# EasyEDA Pro project ProPrj_MiniFoc_AT32F435.epro, schematic 核心板
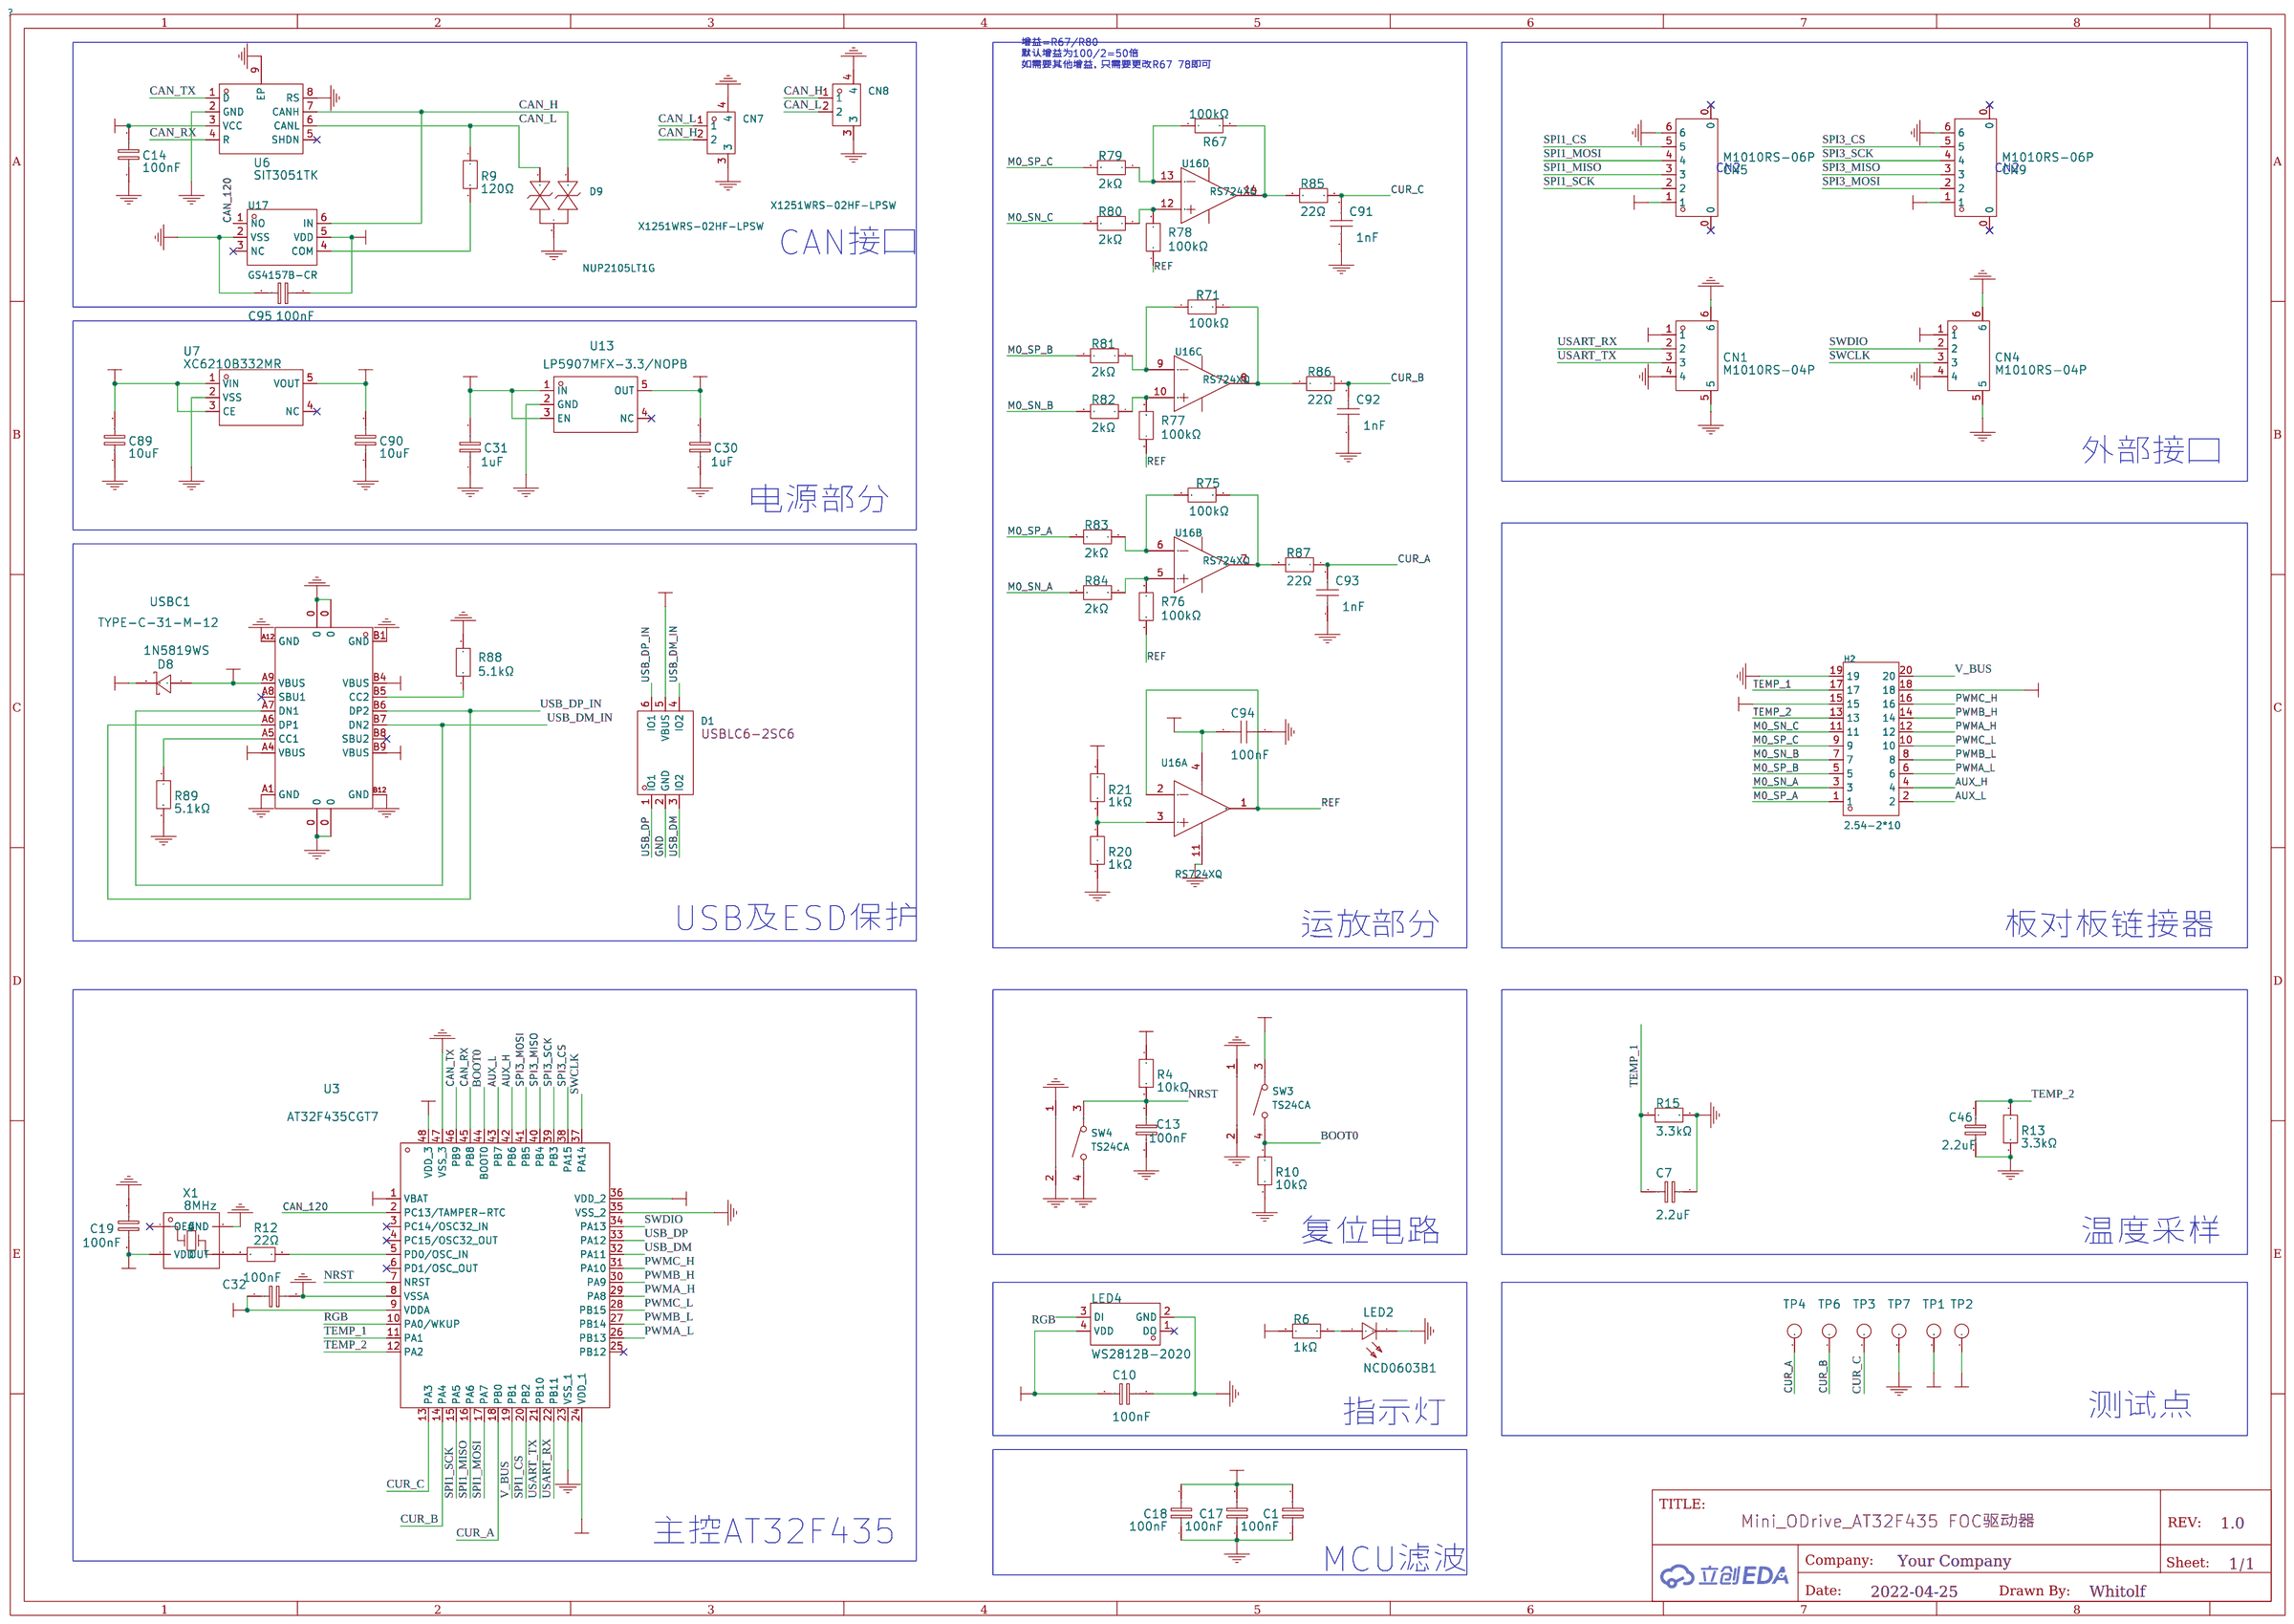
[diagram p0: schematic sheet]

## Parts
C1  100nF  [C0603_SMALL]
C7  2.2uF  [C0603_SMALL]
C10  100nF  [C0603_SMALL]
C13  100nF  [C0603_SMALL]
C14  100nF  [C0603_SMALL]
C17  100nF  [C0603_SMALL]
C18  100nF  [C0603_SMALL]
C19  100nF  [C0603_SMALL]
C30  1uF  [C0603_SMALL]
C31  1uF  [C0603_SMALL]
C32  100nF  [C0603_SMALL]
C46  2.2uF  [C0603_SMALL]
C89  10uF  [C0603_SMALL]
C90  10uF  [C0603_SMALL]
C91  1nF  [C0603_SMALL]
C92  1nF  [C0603_SMALL]
C93  1nF  [C0603_SMALL]
C94  100nF  [C0603_SMALL]
C95  100nF  [C0603_SMALL]
CN1  M1010RS-04P  [CONN-SMD_M1010RS-04P]
CN4  M1010RS-04P  [CONN-SMD_M1010RS-04P]
CN5  M1010RS-06P  [CONN-SMD_M1010RS-06P]
CN7  X1251WRS-02HF-LPSW  [CONN-SMD_2P-P1.25_X1251WRS-02HF-LPSW]
CN8  X1251WRS-02HF-LPSW  [CONN-SMD_2P-P1.25_X1251WRS-02HF-LPSW]
CN9  M1010RS-06P  [CONN-SMD_M1010RS-06P]
D1  -  [SOT-23-6_L2.9-W1.6-P0.95-LS2.8-BL]
D8  1N5819WS  [SOD-323_L1.8-W1.3-LS2.5-RD]
D9  NUP2105LT1G  [SOT-23-3_L2.9-W1.3-P1.90-LS2.4-BR]
H2  2.54-2*10  [HDR-TH_20P-P2.54-V-M-R2-C10-S2.54]
LED2  NCD0603B1  [LED0603_RED_SMALL]
LED4  WS2812B-2020  [LED-SMD_4P-L2.0-W2.0-TL_WS2812B-2020]
R4  10kΩ  [R0603_SMALL]
R6  1kΩ  [R0603_SMALL]
R9  120Ω  [R0603_SMALL]
R10  10kΩ  [R0603_SMALL]
R12  22Ω  [R0603_SMALL]
R13  3.3kΩ  [R0603_SMALL]
R15  3.3kΩ  [R0603_SMALL]
R20  1kΩ  [R0603_SMALL]
R21  1kΩ  [R0603_SMALL]
R67  100kΩ  [R0603_SMALL]
R71  100kΩ  [R0603_SMALL]
R75  100kΩ  [R0603_SMALL]
R76  100kΩ  [R0603_SMALL]
R77  100kΩ  [R0603_SMALL]
R78  100kΩ  [R0603_SMALL]
R79  2kΩ  [R0603_SMALL]
R80  2kΩ  [R0603_SMALL]
R81  2kΩ  [R0603_SMALL]
R82  2kΩ  [R0603_SMALL]
R83  2kΩ  [R0603_SMALL]
R84  2kΩ  [R0603_SMALL]
R85  22Ω  [R0603_SMALL]
R86  22Ω  [R0603_SMALL]
R87  22Ω  [R0603_SMALL]
R88  5.1kΩ  [R0603_SMALL]
R89  5.1kΩ  [R0603_SMALL]
SW3  TS24CA  [SW-SMD_TS24CA]
SW4  TS24CA  [SW-SMD_TS24CA]
TP1  Testpoint 1.6mm  [TESTPOINT 1.6MM]  (no BOM)
TP2  Testpoint 1.6mm  [TESTPOINT 1.6MM]  (no BOM)
TP3  Testpoint 1.6mm  [TESTPOINT 1.6MM]  (no BOM)
TP4  Testpoint 1.6mm  [TESTPOINT 1.6MM]  (no BOM)
TP6  Testpoint 1.6mm  [TESTPOINT 1.6MM]  (no BOM)
TP7  Testpoint 1.6mm  [TESTPOINT 1.6MM]  (no BOM)
U3  AT32F435CGT7  [LQFP-48_L7.0-W7.0-P0.50-LS9.0-BL]
U6  SIT3051TK  [DFN-8_L3.0-W3.0-P0.65-BL-EP]
U7  XC6210B332MR  [SOT-25_L3.0-W1.6-P0.95-LS2.8-BL]
U13  LP5907MFX-3.3/NOPB  [SOT-23-5_L3.0-W1.7-P0.95-LS2.8-BR]
U16  RS724XQ  [TSSOP-14_L5.0-W4.4-P0.65-LS6.4-BL]  (sections 1,2,3,4)
U17  GS4157B-CR  [SC70-6_L2.1-W1.3-P0.65-LS2.3-BL]
USBC1  TYPE-C-31-M-12  [USB-C_SMD-TYPE-C-31-M-12]
X1  8MHz  [OSC-SMD_4P-L2.5-W2.0-BL_DSB321SDA]

## Library data of the parts
C1 C10 C13 C14 C17-C19 C32 C95 = CC0603KRX7R9BB104: 容值:100nF;精度:±10%;额定电压:50V;材质(温度系数):X7R;; LCSC Part Name: 100nF ±10% 50V; Supplier Part: C14663; Manufacturer: YAGEO(国巨); Supplier Footprint: 0603; JLCPCB Part Class: Basic Part; Datasheet: https://atta.szlcsc.com/upload/public/pdf/source/20180910/C282072_33301C7F631E79921B82A8DAC6BCC5B3.pdf; Supplier: LCSC; Tolerance: ±10%; Voltage Rated: 50V; Temperature Coefficient: X7R; Check: true
C7 C46 = CL10A225KO8NNNC: 容值:2.2uF;精度:±10%;额定电压:16V;材质(温度系数):X5R;; LCSC Part Name: 2.2uF ±10% 16V; Supplier Part: C23630; Manufacturer: SAMSUNG(三星); Supplier Footprint: 0603; JLCPCB Part Class: Basic Part; Datasheet: https://atta.szlcsc.com/upload/public/pdf/source/20160218/1457707763339.pdf; Supplier: LCSC; Tolerance: ±10%; Voltage Rated: 16V; Temperature Coefficient: X5R; Check: true
C30 C31 C91-C93 = CC0603KRX5R8BB105: 容值:1uF;精度:±10%;额定电压:25V;材质(温度系数):X5R;; LCSC Part Name: 1uF ±10% 25V; Supplier Part: C14664; Manufacturer: YAGEO(国巨); Supplier Footprint: 0603; JLCPCB Part Class: Extended Part; Datasheet: https://atta.szlcsc.com/upload/public/pdf/source/20160606/1465200209684.pdf; Supplier: LCSC; Tolerance: ±10%; Voltage Rated: 25V; Temperature Coefficient: X5R; Check: true
C89 C90 = GRM188R6YA106MA73D: 容值:10uF;精度:±20%;额定电压:35V;材质(温度系数):-;; LCSC Part Name: 10uF ±20% 35V; Supplier Part: C194427; Manufacturer: muRata(村田); Supplier Footprint: 0603; JLCPCB Part Class: Extended Part; Datasheet: https://atta.szlcsc.com/upload/public/pdf/source/20210128/C194427_FCA3640823207DDB58700A82F1A19B5F.pdf; Supplier: LCSC; Tolerance: ±20%; Voltage Rated: 35V; Check: true
C94 = CC0603KRX5R8BB105: 容值:1uF;精度:±10%;额定电压:25V;材质(温度系数):X5R;; LCSC Part Name: 1uF ±10% 25V; Supplier Part: C14663; Manufacturer: YAGEO(国巨); Manufacturer Part: CC0603KRX7R9BB104; Supplier Footprint: 0603; JLCPCB Part Class: Extended Part; Datasheet: https://atta.szlcsc.com/upload/public/pdf/source/20160606/1465200209684.pdf; Supplier: LCSC; Tolerance: ±10%; Voltage Rated: 25V; Temperature Coefficient: X5R; Check: true
CN1 CN4 = M1010RS-04P: 参考系列:-;间距:1mm;插针结构:1x4P;排数:1;每排PIN数:4;行距:-;公母:公型插针;安装方式:卧贴;额定电流:1A;工作温度范围:-25℃~+85℃;; LCSC Part Name: 针座 SH 间距1.0mm 4P 卧式贴片 SH; Supplier Part: C541846; Manufacturer: XFCN(台湾兴飞); Supplier Footprint: SMD,P=1mm; JLCPCB Part Class: Extended Part; Datasheet: https://atta.szlcsc.com/upload/public/pdf/source/20200518/C541847_4FBBB7CE1CCFE042AF6DD43CBAA42E89.pdf; Supplier: LCSC; Pitch: 1mm; Pins Structure: 1x4P; Number of Rows: 1; Number of PINs Per Row: 4; Gender: 公型插针; Mounting Style: 卧贴; Current Rating (Max): 1A; Operating Temperature Range: -25℃~+85℃
CN5 CN9 = M1010RS-06P: 参考系列:-;间距:1mm;插针结构:1x6P;排数:1;每排PIN数:6;行距:-;公母:公型插针;安装方式:卧贴;额定电流:1A;工作温度范围:-25℃~+85℃;; LCSC Part Name: 针座 SH 间距1.0mm 6P 卧式贴片 SH; Supplier Part: C541848; Manufacturer: XFCN(台湾兴飞); Supplier Footprint: SMD,P=1mm; JLCPCB Part Class: Extended Part; Datasheet: https://atta.szlcsc.com/upload/public/pdf/source/20200518/C541847_4FBBB7CE1CCFE042AF6DD43CBAA42E89.pdf; Supplier: LCSC; Pitch: 1mm; Pins Structure: 1x6P; Number of Rows: 1; Number of PINs Per Row: 6; Gender: 公型插针; Mounting Style: 卧贴; Current Rating (Max): 1A; Operating Temperature Range: -25℃~+85℃
CN7 CN8 = X1251WRS-02HF-LPSW: 参考系列:GH;间距:1.25mm;插针结构:1x2P;排数:1;每排PIN数:2;行距:-;公母:母型插口;安装方式:卧贴;额定电流:1A;触头材质:磷青铜;触头镀层:锡;工作温度范围:-40℃~+110℃;焊接温度(最大值):260℃;; LCSC Part Name: GH 1.25mm 1x2P 卧贴 GH; Supplier Part: C388707; Manufacturer: XKB Connectivity(中国星坤); Supplier Footprint: SMD,P=1.25mm; JLCPCB Part Class: Extended Part; Datasheet: https://atta.szlcsc.com/upload/public/pdf/source/20211011/E2F7306AE87519079AD4EC816349A567.pdf; Supplier: LCSC; Reference Series: GH; Pitch: 1.25mm; Pins Structure: 1x2P; Number of Rows: 1; Number of PINs Per Row: 2; Gender: 母型插口; Mounting Style: 卧贴; Current Rating (Max): 1A; Contact Material: 磷青铜; Contact Plating: 锡; Operating Temperature Range: -40℃~+110℃; Welding Temperature (Max): 260℃
D1 = USBLC6-2SC6: 极性:-;反向关断电压（典型值）:-;击穿电压（最小值）:-;箝位电压:-;峰值脉冲电流（10/1000us）:-;; Supplier Part: C2827654; Manufacturer: TECH PUBLIC(台舟); Supplier Footprint: SOT-23-6; JLCPCB Part Class: Extended Part; Datasheet: https://atta.szlcsc.com/upload/public/pdf/source/20210810/FBD75DE717D6D97BAC6DD7F2B5C09DCD.pdf; Supplier: LCSC
D8 = 1N5819WS_C191023: 直流反向耐压(Vr):40V;平均整流电流(Io):1A;正向压降(Vf):600mV@1A;; LCSC Part Name: 40V 1A 600mV@1A; Supplier Part: C191023; Manufacturer: Hottech(合科泰); Supplier Footprint: SOD-323; JLCPCB Part Class: Basic Part; Datasheet: https://atta.szlcsc.com/upload/public/pdf/source/20220428/3CB86FD8D28D653594B4E35F9D5AEFD9.pdf; Supplier: LCSC; Reverse Voltage (Vr): 40V; Average Rectified Current (Io): 1A; Forward Voltage (Vf@If): 600mV@1A
D9 = NUP2105LT1G_C2890118: Supplier Part: C2890118; Manufacturer: TECH PUBLIC(台舟); Supplier Footprint: SOT-23; JLCPCB Part Class: 扩展库; Datasheet: https://atta.szlcsc.com/upload/public/pdf/source/20210903/C2631C2D315C3B4D2530AFC6AAB84809.pdf; Supplier: LCSC
H2 = 2.54-2*10: 排针 2*10 2.54 11.6 MMROHS; LCSC Part Name: 排针 2*10 2.54 11.6 MMROHS; Supplier Part: C5116480; Manufacturer: ZHOURI(洲日); Supplier Footprint: 插件,P=2.54mm; JLCPCB Part Class: 扩展库; Datasheet: https://atta.szlcsc.com/upload/public/pdf/source/20220412/C6BEA3D643D1CE07163CD717B50927E0.pdf; Supplier: LCSC
LED2 = NCD0603B1: 发光颜色:蓝灯;; LCSC Part Name: 蓝灯; Supplier Part: C84266; Manufacturer: 国星光电; Supplier Footprint: 0603; JLCPCB Part Class: Extended Part; Datasheet: https://atta.szlcsc.com/upload/public/pdf/source/20200820/C84266_6A3CDBEFA72C6CAD68EDA53474ADAE6C.pdf; Supplier: LCSC; Emitted Color: 蓝灯
LED4 = WS2812B-2020: 发光颜色:RGB三色;二极管配置:-;透镜颜色:-;主波长:470.4nm；622.5nm；515.6nm;峰值波长:-;色温:-;测试电流:12mA;功率:-;发光角度:-;安装方式:-;工作温度:-;; LCSC Part Name: RGB三色 470.4nm 515.6nm 622.5nm （注意防潮，请查阅规格书中对应具体内容）; Supplier Part: C965555; Manufacturer: worldsemi; Supplier Footprint: SMD,2x2mm; JLCPCB Part Class: Extended Part; Datasheet: https://atta.szlcsc.com/upload/public/pdf/source/20201203/C965555_5C919C4B6231E6ADE06011FB0D94282B.pdf; Supplier: LCSC; Emitted Color: RGB三色; Dominant Wavelength: 470.4nm；622.5nm；515.6nm; Forward Current: 12mA
R4 R10 R88 R89 = CR0603JA0103G: 电阻类型:厚膜电阻;阻值:10kΩ;精度:±5%;功率:100mW;温度系数:±200ppm/℃;最大工作电压:50V;工作温度范围:-55℃~+125℃;; LCSC Part Name: 10kΩ ±5% 100mW; Supplier Part: C101254; Manufacturer: LIZ(丽智电子); Supplier Footprint: 0603; JLCPCB Part Class: Extended Part; Datasheet: https://atta.szlcsc.com/upload/public/pdf/source/20170408/1491631441449.pdf; Supplier: LCSC; Type: 厚膜电阻; Tolerance: ±5%; Power(Watts): 100mW; Temperature Coefficient: ±200ppm/℃; Overload Voltage (Max): 50V; Operating Temperature Range: -55℃~+125℃; Check: true
R6 R20 R21 = SCR0603J1K: 阻值:1kΩ;精度:±5%;; LCSC Part Name: 1kΩ ±5%; Supplier Part: C3017736; Manufacturer: VO(翔胜); Supplier Footprint: 0603; JLCPCB Part Class: Extended Part; Datasheet: https://atta.szlcsc.com/upload/public/pdf/source/20220513/247AF9639BA21CF93567DC289CCC6A22.pdf; Supplier: LCSC; Tolerance: ±5%; Check: true
R9 = RC0603FR-07120RL: 阻值:120Ω;精度:±1%;功率:100mW;温度系数:±100ppm/℃;最大工作电压:75V;工作温度范围:-55℃~+155℃;; LCSC Part Name: 120Ω ±1% 100mW; Supplier Part: C114640; Manufacturer: YAGEO(国巨); Supplier Footprint: 0603; JLCPCB Part Class: Extended Part; Datasheet: https://atta.szlcsc.com/upload/public/pdf/source/20170818/C114640_1503051151018895125.pdf; Supplier: LCSC; Tolerance: ±1%; Power(Watts): 100mW; Temperature Coefficient: ±100ppm/℃; Overload Voltage (Max): 75V; Operating Temperature Range: -55℃~+155℃; Check: true
R12 = CR0603J22R0P05Z: 阻值:22Ω;精度:±5%;功率:100mW;温度系数:±100ppm/℃;; LCSC Part Name: 22Ω ±5% 100mW; Supplier Part: C881386; Manufacturer: EVER OHMS(天二科技); Supplier Footprint: 0603; JLCPCB Part Class: Extended Part; Datasheet: https://atta.szlcsc.com/upload/public/pdf/source/20201014/C881429_ABC29D63C8D6A11EB63D87348B25AA7B.pdf; Supplier: LCSC; Tolerance: ±5%; Power(Watts): 100mW; Temperature Coefficient: ±100ppm/℃; Check: true
R13 R15 = CR0603F3K30P05Z: 阻值:3.3kΩ;精度:±1%;功率:100mW;温度系数:±100ppm/℃;; LCSC Part Name: 3.3kΩ ±1% 100mW; Supplier Part: C880995; Manufacturer: EVER OHMS(天二科技); Supplier Footprint: 0603; JLCPCB Part Class: Extended Part; Datasheet: https://atta.szlcsc.com/upload/public/pdf/source/20201014/C881429_ABC29D63C8D6A11EB63D87348B25AA7B.pdf; Supplier: LCSC; Tolerance: ±1%; Power(Watts): 100mW; Temperature Coefficient: ±100ppm/℃; Check: true
R67 R71 R75-R78 = RT0603BRD07100KL: 电阻类型:薄膜电阻;阻值:100kΩ;精度:±0.1%;功率:100mW;; LCSC Part Name: 100kΩ ±0.1% 100mW; Supplier Part: C122538; Manufacturer: YAGEO(国巨); Supplier Footprint: 0603; JLCPCB Part Class: Extended Part; Datasheet: https://atta.szlcsc.com/upload/public/pdf/source/20170721/C122538_1500619326323834092.pdf; Supplier: LCSC; Type: 薄膜电阻; Tolerance: ±0.1%; Power(Watts): 100mW; Temperature Coefficient: ±25ppm/℃; Overload Voltage (Max): 75V; Operating Temperature Range: -55℃~+155℃; Check: true
R79-R84 = 0603WAF2001T5E: 阻值:2kΩ;精度:±1%;功率:100mW;温度系数:±100ppm/℃;电阻类型:厚膜电阻;; LCSC Part Name: 2kΩ ±1% 100mW 厚膜电阻; Supplier Part: C22975; Manufacturer: UNI-ROYAL(厚声); Supplier Footprint: 0603; JLCPCB Part Class: Basic Part; Datasheet: https://atta.szlcsc.com/upload/public/pdf/source/20200306/C422600_1E6D84923E4A46A82E41ADD87F860B5C.pdf; Supplier: LCSC; Tolerance: ±1%; Power(Watts): 100mW; Overload Voltage (Max): 75V; Temperature Coefficient: ±100ppm/℃; Type: 厚膜电阻; Operating Temperature Range: -55℃~+155℃; Check: true
R85-R87 = 0603WAF220JT5E: 阻值:22Ω;精度:±1%;功率:100mW;温度系数:±100ppm/℃;电阻类型:厚膜电阻;; LCSC Part Name: 22Ω ±1% 100mW 厚膜电阻; Supplier Part: C23345; Manufacturer: UNI-ROYAL(厚声); Supplier Footprint: 0603; JLCPCB Part Class: Basic Part; Datasheet: https://atta.szlcsc.com/upload/public/pdf/source/20200306/C422600_1E6D84923E4A46A82E41ADD87F860B5C.pdf; Supplier: LCSC; Tolerance: ±1%; Power(Watts): 100mW; Overload Voltage (Max): 75V; Temperature Coefficient: ±100ppm/℃; Type: 厚膜电阻; Operating Temperature Range: -55℃~+155℃; Check: true
SW3 SW4 = TS24CA: 触点电流:50mA;额定电压(DC):12V;电路结构:单刀单掷;安装方式:卧贴;带灯:-;机械寿命:-;; LCSC Part Name: 4.55*1.8*3.5mm 卧贴 轻触开关; Supplier Part: C393942; Manufacturer: SHOU HAN(首韩); Supplier Footprint: SMD; JLCPCB Part Class: Extended Part; Datasheet: https://atta.szlcsc.com/upload/public/pdf/source/20190521/C393942_591A9E318887EFA4274D34029981AD99.pdf; Supplier: LCSC; Contact Current: 50mA; Voltage Rating (DC): 12V; Circuit: 单刀单掷; Mounting Style: 卧贴; Actuator Style: 矩形按钮; Switch Length: 4.55mm; Switch Width: 1.8mm; Switch Height: 3.5mm
TP1-TP4 TP6 TP7 = Testpoint 1.6mm: Check: true
U3 = AT32F403ACGT7: 频率 (MHz)：240，FLASH (KB)：1024，SRAM (KB)：224，CPU：ARM? Cortex?-M4，工作电压（V）：2.6~3.6，工作温度：-40°C ~ 105°C，封装：LQFP48; Supplier Part: C5178938; Manufacturer: ARTERY（雅特力）; Supplier Footprint: LQFP-48; JLCPCB Part Class: Extended Part; Datasheet: https://atta.szlcsc.com/upload/public/pdf/source/20200507/C528435_60E4F7A933572380D38CD1507797F883.pdf; Supplier: LCSC
U6 = SIT3051TK: 类型:-;协议类别:-;驱动器/接收器数:-;数据速率:-;; LCSC Part Name: CAN收发器芯片; Supplier Part: C601078; Manufacturer: SIT(芯力特); Supplier Footprint: DFN3x3-8; JLCPCB Part Class: Extended Part; Datasheet: https://atta.szlcsc.com/upload/public/pdf/source/20200610/C601078_B1F4AB5D187DBA98E917965AB02FEC6C.pdf; Supplier: LCSC
U7 = XC6210B332MR_C424705: 输出类型:固定;输出极性:正;输出通道数:1;最大输入电压:6V;输出电压:3.3V;压差:75mV@(100mA);输出电流:900mA;电源纹波抑制比(PRSS):60dB@(1kHz);; LCSC Part Name: Vin=6V Vout=3.3V 900mA 60dB@(1kHz); Supplier Part: C424705; Manufacturer: TOREX(特瑞仕); Supplier Footprint: SOT-25; JLCPCB Part Class: Extended Part; Datasheet: https://atta.szlcsc.com/upload/public/pdf/source/20190903/C424705_1DFB2113A9A78D399905DBF688657204.pdf; Supplier: LCSC; Output Type: 固定; Output Polarity: 正; Number of Outputs: 1; Maximum Input Voltage: 6V; Output Voltage: 3.3V; Dropout Voltage: 75mV@(100mA); Output Current: 900mA; Power Supply Rejection Ratio (PRSS): 60dB@(1kHz)
U13 = LP5907MFX-3.3/NOPB: 输出类型:固定;输出极性:正;输出通道数:1;最大输入电压:5.5V;输出电压:3.3V;压差:250mV@(250mA);输出电流:250mA;电源纹波抑制比(PSRR):90dB;; LCSC Part Name: 正 Vin=5.5V Vout=3.3V 250mA 90dB; Supplier Part: C80670; Manufacturer: TI(德州仪器); Supplier Footprint: SOT-23-5; JLCPCB Part Class: Extended Part; Datasheet: https://atta.szlcsc.com/upload/public/pdf/source/20160830/1472551528598.pdf; Supplier: LCSC; Output Type: 固定; Output Polarity: 正; Number of Outputs: 1; Maximum Input Voltage: 5.5V; Output Voltage: 3.3V; Dropout Voltage: 250mV@(250mA); Output Current: 250mA; Power Supply Rejection Ratio (PSRR): 90dB; Power Supply Rejection Ratio (PRSS): 90dB@(100Hz),60dB@(100kHz)
U16 = RS724XQ: 超低噪声9.5nV/√Hz,10MHz,4通道运放; LCSC Part Name: 低噪声运放RS724XQ; Supplier Part: C255447; Manufacturer: RUNIC(润石); Supplier Footprint: TSSOP-14; JLCPCB Part Class: 扩展库; Datasheet: https://atta.szlcsc.com/upload/public/pdf/source/20180801/C255447_BE3BEC7F638DC7BEBCC129246595435E.pdf; Supplier: LCSC
U17 = GS4157B-CR: 开关电路:-;通道数:1;导通电阻(Ron@VCC):800mΩ;; Supplier Part: C840035; Manufacturer: Gainsil(聚洵); Supplier Footprint: SC-70-6; JLCPCB Part Class: 扩展库; Datasheet: https://atta.szlcsc.com/upload/public/pdf/source/20220610/2A35EEEA3768DDA130F8C36B48DE8A34.pdf; Supplier: LCSC; Number of Channels: 1; Supply Voltage: 1.8V~5.5V; Turn-on time: 28ns; On-State Resistance (Max): 800mΩ; Turn-off time: 23ns; Operating Temperature: -40℃~+125℃
USBC1 = TYPE-C-31-M-12: 连接器类型:Type-C;标准:-;公母:母座;触点数量:16;端口数量:1;安装方式:-;额定电流 - 电源:5A;触头材质:-;触头镀层:-;工作温度范围:-;焊接温度(最大值):-;; LCSC Part Name: Type-C 母座; Supplier Part: C165948; Manufacturer: 韩国韩荣; Supplier Footprint: SMD; JLCPCB Part Class: Extended Part; Datasheet: https://atta.szlcsc.com/upload/public/pdf/source/20220525/466408E853115E789EDB0DDC29077C05.pdf; Supplier: LCSC; Connector Type: Type-C; Gender: 母座; Number of Contacts: 16; Number of Ports: 1; Current Rating - Power (Max): 5A
X1 = 2N08000G33YC: Supplier: LCSC; Supplier Part: C252325; Manufacturer: SHENZHEN CRYSTAL TECH; JLCPCB Part Class: Extended Part

## Nets
5V: C10.1 C31.2 C89.2 CN1.1 D1.5(VBUS) D8.1(C) H2.18 LED4.4(VDD) TP2.1 U7.1(VIN) U7.3(CE) U13.1(IN) U13.3(EN)
AVCC: C30.2 C32.1 C94.2 R21.1 U3.9(VDDA) U13.5(OUT) U16.4(V+)
GND: C1.1 C7.1 C10.2 C13.1 C14.1 C17.1 C18.1 C19.1 C30.1 C31.1 C32.2 C46.1 C89.1 C90.1 C91.1 C92.1 C93.1 C94.1 C95.2 CN1.4 CN1.5 CN1.6 CN4.4 CN4.5 CN4.6 CN5.6 CN7.3 CN7.4 CN8.3 CN8.4 CN9.6 D1.2(GND) D9.3(A) H2.19 LED2.1(K) LED4.2(GND) R10.2 R13.2 R15.2 R20.2 R88.2 R89.2 SW3.1 SW3.2 SW4.1 SW4.2 SW4.4 TP7.1 U3.8(VSSA) U3.23(VSS_1) U3.35(VSS_2) U3.47(VSS_3) U6.2(GND) U6.8(RS) U6.9(EP) U7.2(VSS) U13.2(GND) U16.11(V-) U17.2(VSS) USBC1.0 USBC1.A1(GND) USBC1.A12(GND) USBC1.B1(GND) USBC1.B12(GND) X1.2(GND)
VCC: C1.2 C14.2 C17.2 C18.2 C19.2 C90.2 C95.1 CN4.1 CN5.1 CN9.1 H2.15 R4.1 R6.1 SW3.3 TP1.1 U3.1(VBAT) U3.24(VDD_1) U3.36(VDD_2) U3.48(VDD_3) U6.3(VCC) U7.5(VOUT) U17.5(VDD) X1.4(VDD)
AUX_H: H2.4 U3.42(PB6)
AUX_L: H2.2 U3.43(PB7)
BOOT0: R10.1 SW3.4 U3.44(BOOT0)
CAN_120: U3.2(PC13/TAMPER-RTC) U17.1(NO)
CAN_H: CN7.2 CN8.1 D9.1(C) U6.7(CANH) U17.6(IN)
CAN_L: CN7.1 CN8.2 D9.2(C) R9.1 U6.6(CANL)
CAN_RX: U3.45(PB8) U6.4(R)
CAN_TX: U3.46(PB9) U6.1(D)
CUR_A: C93.2 R87.1 TP4.1 U3.18(PB0)
CUR_B: C92.2 R86.1 TP6.1 U3.14(PA4)
CUR_C: C91.2 R85.1 TP3.1 U3.13(PA3)
M0_SN_A: H2.3 R84.2
M0_SN_B: H2.7 R82.2
M0_SN_C: H2.11 R80.2
M0_SP_A: H2.1 R83.2
M0_SP_B: H2.5 R81.2
M0_SP_C: H2.9 R79.2
NRST: C13.2 R4.2 SW4.3 U3.7(NRST)
PWMA_H: H2.12 U3.29(PA8)
PWMA_L: H2.6 U3.26(PB13)
PWMB_H: H2.14 U3.30(PA9)
PWMB_L: H2.8 U3.27(PB14)
PWMC_H: H2.16 U3.31(PA10)
PWMC_L: H2.10 U3.28(PB15)
REF: R76.1 R77.1 R78.1 U16.1(OUTA) U16.2(-INA)
RGB: LED4.3(DI) U3.10(PA0/WKUP)
SPI1_CS: CN5.5 U3.20(PB2)
SPI1_MISO: CN5.3 U3.16(PA6)
SPI1_MOSI: CN5.4 U3.17(PA7)
SPI1_SCK: CN5.2 U3.15(PA5)
SPI3_CS: CN9.5 U3.38(PA15)
SPI3_MISO: CN9.3 U3.40(PB4)
SPI3_MOSI: CN9.2 U3.41(PB5)
SPI3_SCK: CN9.4 U3.39(PB3)
SWCLK: CN4.3 U3.37(PA14)
SWDIO: CN4.2 U3.34(PA13)
TEMP_1: C7.2 H2.17 R15.1 U3.11(PA1)
TEMP_2: C46.2 H2.13 R13.1 U3.12(PA2)
USART_RX: CN1.2 U3.22(PB11)
USART_TX: CN1.3 U3.21(PB10)
USB_DM: D1.3(IO2) U3.32(PA11)
USB_DM_IN: D1.4(IO2) USBC1.A7(DN1) USBC1.B7(DN2)
USB_DP: D1.1(IO1) U3.33(PA12)
USB_DP_IN: D1.6(IO1) USBC1.A6(DP1) USBC1.B6(DP2)
V_BUS: H2.20 U3.19(PB1)
VUSB: D8.2(A) USBC1.A4(VBUS) USBC1.A9(VBUS) USBC1.B4(VBUS) USBC1.B9(VBUS)
$3N234: LED2.2(A) R6.2
$3N656: R12.1 U3.5(PD0/OSC_IN)
$3N953: R12.2 X1.3(OUT)
$3N32197: R20.1 R21.2 U16.3(+INA)
$3N32209: R71.1 R81.1 U16.9(-INC)
$3N32210: R75.1 R83.1 U16.6(-INB)
$3N32219: R67.1 R79.1 U16.13(-IND)
$3N32226: R75.2 R87.2 U16.7(OUTB)
$3N32227: R71.2 R86.2 U16.8(OUTC)
$3N32228: R67.2 R85.2 U16.14(OUTD)
$3N32230: R76.2 R84.1 U16.5(+INB)
$3N32232: R77.2 R82.1 U16.10(+INC)
$3N32233: R78.2 R80.1 U16.12(+IND)
$3N32457: R88.1 USBC1.B5(CC2)
$3N32516: R89.1 USBC1.A5(CC1)
$3N63623: R9.2 U17.4(COM)

Not connected (* = marked no-connect by the designer): CN5 0*; CN9 0*; LED4 1(DO)*; U3 3(PC14/OSC32_IN)* 4(PC15/OSC32_OUT)* 6(PD1/OSC_OUT)* 25(PB12)*; U6 5(SHDN)*; U7 4(NC)*; U13 4(NC)*; U17 3(NC)*; USBC1 A8(SBU1)* B8(SBU2)*; X1 1(OE#)*

## Notes on the sheet
- 增益=R67/R80
  默认增益为100/2=50倍
  如需要其他增益，只需要更改R67 78即可
- CN2
- CN2
- CAN接口
- 外部接口
- 电源部分
- USB及ESD保护
- 运放部分
- 板对板链接器
- 复位电路
- 温度采样
- 指示灯
- 测试点
- 主控AT32F435
- MCU滤波
